# Altium schematic sheet Microcontroller.SchDoc: STM32F407 Main µController
size A4; Organization: Use Organization_Name in ProjParam; Address1: EFI & DBR; Address2: STI-IMT-LSRO1; Address3: EPFL; Address4: CH-1015 LAUSANNE; DocumentNumber: 11; Revision: A; SheetNumber: 12; SheetTotal: 2; ApprovedBy: Init ApprovedBy in DocParam; CheckedBy: Init CheckedBy in DocParam; Author: Init Author in DocParam; CompanyName: Init CompanyName in DocParam; DrawnBy: Init DrawBy in DocParam; Engineer: Init Engineer in DocParam; DocumentName: Init DocumentName in DocParam; ProjectName: Init ProjectName in DocParam
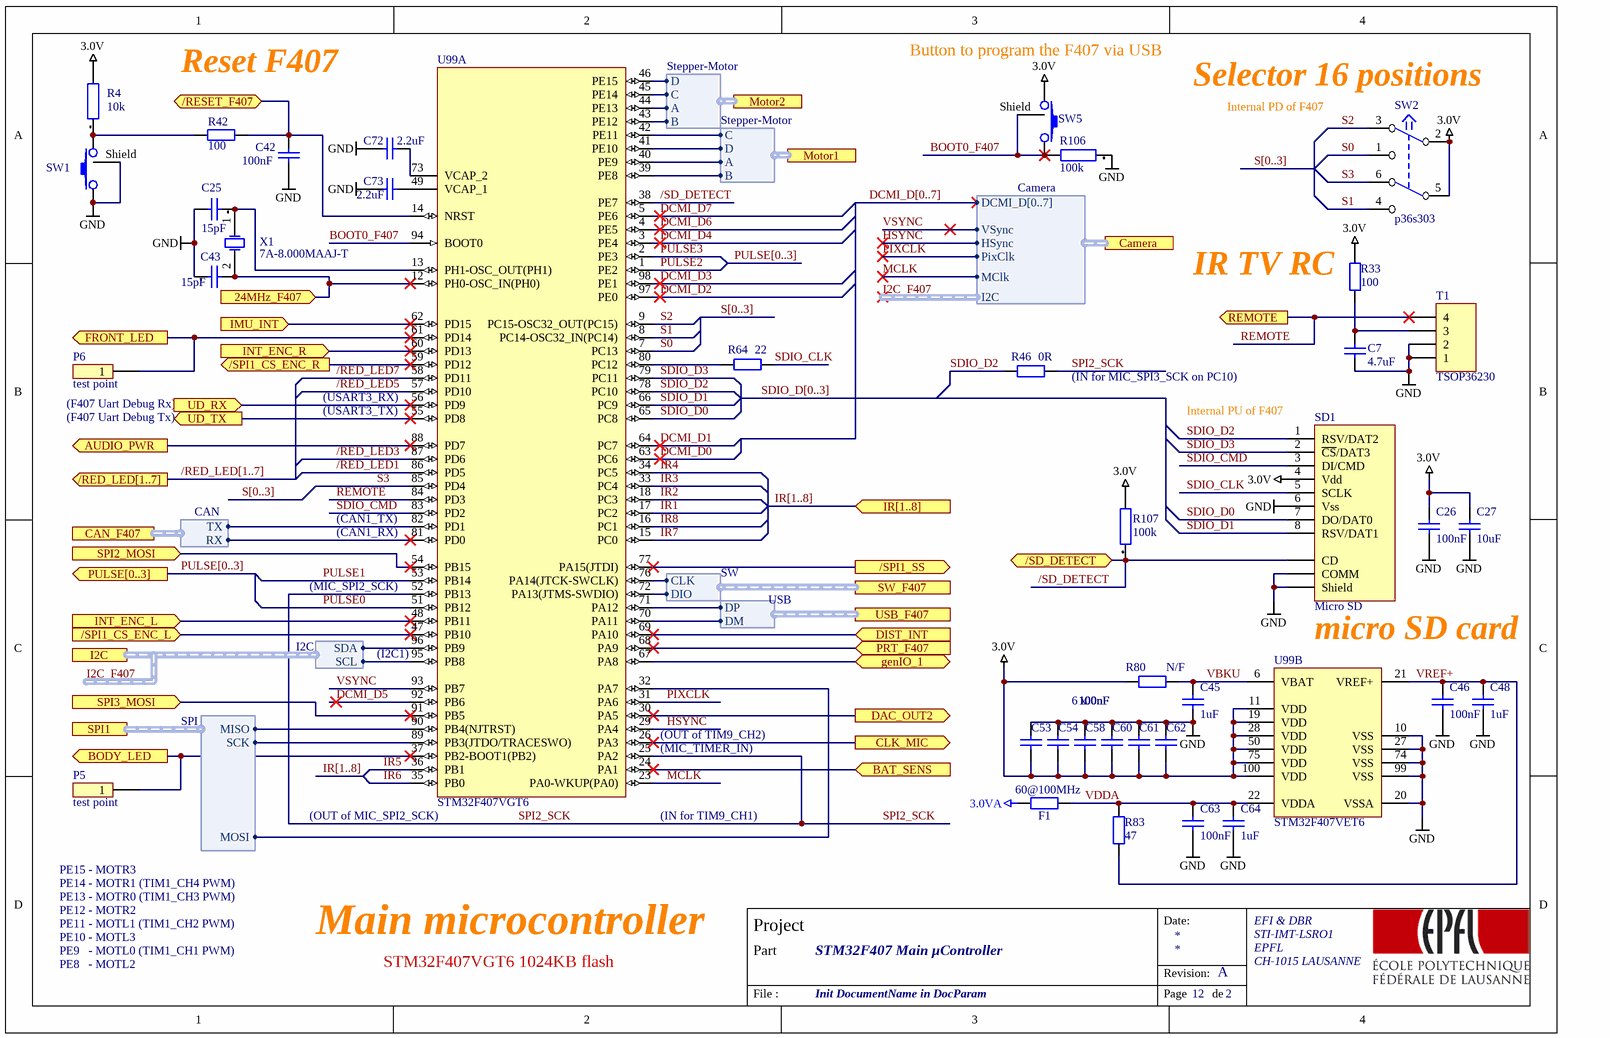
[diagram p0: Microcontroller.SchDoc]

## Parts
C7  4.7uF  [ROB_0603]
C25  15pF  [ROB_0603]
C26  100nF  [ROB_0603]
C27  10uF  [ROB_0603]
C42  100nF  [ROB_0603]
C43  15pF  [ROB_0603]
C45  1uF  [ROB_0603]
C46  100nF  [ROB_0603]
C48  1uF  [ROB_0603]
C53  100nF  [ROB_0603]
C54  100nF  [ROB_0603]
C58  100nF  [ROB_0603]
C60  100nF  [ROB_0603]
C61  100nF  [ROB_0603]
C62  100nF  [ROB_0603]
C63  100nF  [ROB_0603]
C64  1uF  [ROB_0603]
C72  2.2uF  [ROB_0603]
C73  2.2uF  [ROB_0603]
F1  60@100MHz  [rob_0603]
P5  test point  [testpoint]
P6  test point  [testpoint]
R4  10k  [ROB_0603]
R33  100  [ROB_0603]
R42  100  [ROB_0603]
R46  0R  [ROB_0603]
R64  22  [ROB_0603]
R80  N/F  [ROB_0603]
R83  47  [ROB_0603]
R106  100k  [ROB_0603]
R107  100k  [ROB_0603]
SD1  Micro SD  [MicroSD_DM3AT-SF-PEJM5]
SW1  button  [C&K_KMR2]  (value not drawn)
SW2  p36s303  [p36s]
SW5  button  [C&K_KMR2]  (value not drawn)
T1  TSOP36230  [TSOP36230]
U99  STM32F407VGT6  [STM-LQFP100_N]  (parts A,B of 2)
X1  7A-8.000MAAJ-T  [Crystal 8MHz 3.2x5mm-7A-8.000MAAJ-T]

## Ports
24MHz_F407 (in), /RED_LED[1..7] (out), /RESET_F407 (bidir), /SD_DETECT (bidir), /SPI1_CS_ENC_L (in), /SPI1_CS_ENC_R (out), /SPI1_SS (out), AUDIO_PWR (out), BAT_SENS (in), BODY_LED (out), Camera (harness Camera), CAN_F407 (harness CAN), CLK_MIC (out), DAC_OUT2 (out), DIST_INT (in), FRONT_LED (out), genIO_1 (bidir), I2C (harness I2C), IMU_INT (in), INT_ENC_L (in), INT_ENC_R (in), IR[1..8] (in), Motor1 (harness Stepper-Motor), Motor2 (harness Stepper-Motor), PRT_F407 (in), PULSE[0..3] (out), REMOTE (out), SPI1 (harness SPI), SPI2_MOSI (in), SPI3_MOSI (in), SW_F407 (harness SW), UD_RX (in), UD_TX (out), USB_F407 (harness USB)

## Harnesses
Camera: DCMI_D[0..7], HSync, VSync, MClk, PixClk, I2C
Stepper-Motor: A, B, C, D
CAN: TX, RX
SW: DIO, CLK
USB: DP, DM
I2C: SDA, SCL
SPI: SCK, MOSI, MISO

## Nets
3.0V: C26.2 C27.2 C53.1 C54.1 C58.1 C60.1 C61.1 C62.1 R4.2 R33.2 R80.2 R107.2 SD1.4(Vdd) SW2.2(COM1) SW2.5(COM2) SW5.2 U99.11(VDD) U99.19(VDD) U99.28(VDD) U99.50(VDD) U99.75(VDD) U99.100(VDD)
3.0VA: F1.1
GND: C7.1 C25.2 C26.1 C27.1 C42.2 C43.1 C45.1 C46.1 C48.1 C53.2 C54.2 C58.2 C60.2 C61.2 C62.2 C63.1 C64.1 C72.2 C73.1 R106.1 SD1.6(Vss) SD1.COMM SD1.S(Shield) SW1.1 SW1.Shield T1.1 T1.2 U99.10(VSS) U99.20(VSSA) U99.27(VSS) U99.74(VSS) U99.99(VSS)
24MHz_F407: C43.2 U99.12(PH0-OSC_IN(PH0)) X1.2(OSC2) ; port 24MHz_F407
/RED_LED1: U99.86(PD5)
/RED_LED3: U99.87(PD6)
/RED_LED5: U99.57(PD10)
/RED_LED7: U99.58(PD11)
/RESET_F407: C42.1 R42.2 U99.14(NRST) ; port /RESET_F407
/SD_DETECT: R107.1 SD1.CD U99.38(PE7) ; port /SD_DETECT
/SPI1_CS_ENC_L: U99.47(PB10) ; port /SPI1_CS_ENC_L
/SPI1_CS_ENC_R: U99.59(PD12) ; port /SPI1_CS_ENC_R
/SPI1_SS: U99.77(PA15(JTDI)) ; port /SPI1_SS
AUDIO_PWR: U99.88(PD7) ; port AUDIO_PWR
BAT_SENS: U99.24(PA1) ; port BAT_SENS
BODY_LED: P5.1 U99.37(PB2-BOOT1(PB2)) ; port BODY_LED
BOOT0_F407: R106.2 SW5.1 SW5.Shield U99.94(BOOT0)
CLK_MIC: U99.26(PA3) ; port CLK_MIC
DAC_OUT2: U99.30(PA5) ; port DAC_OUT2
DCMI_D0: U99.63(PC6)
DCMI_D1: U99.64(PC7)
DCMI_D2: U99.97(PE0)
DCMI_D3: U99.98(PE1)
DCMI_D4: U99.3(PE4)
DCMI_D5: U99.92(PB6)
DCMI_D6: U99.4(PE5)
DCMI_D7: U99.5(PE6)
DIST_INT: U99.69(PA10) ; port DIST_INT
FRONT_LED: P6.1 U99.61(PD14) ; port FRONT_LED
genIO_1: U99.67(PA8) ; port genIO_1
HSYNC: U99.29(PA4) ; port Camera.HSync
I2C_F407.SCL: U99.95(PB8) ; port I2C.SCL
I2C_F407.SDA: U99.96(PB9) ; port I2C.SDA
IMU_INT: U99.62(PD15) ; port IMU_INT
INT_ENC_L: U99.48(PB11) ; port INT_ENC_L
INT_ENC_R: U99.60(PD13) ; port INT_ENC_R
IR1: U99.17(PC2)
IR2: U99.18(PC3)
IR3: U99.33(PC4)
IR4: U99.34(PC5)
IR5: U99.36(PB1)
IR6: U99.35(PB0)
IR7: U99.15(PC0)
IR8: U99.16(PC1)
MCLK: U99.23(PA0-WKUP(PA0)) ; port Camera.MClk
PIXCLK: U99.31(PA6) ; port Camera.PixClk
PRT_F407: U99.68(PA9) ; port PRT_F407
PULSE0: U99.51(PB12)
PULSE1: U99.53(PB14)
PULSE2: U99.1(PE2)
PULSE3: U99.2(PE3)
REMOTE: T1.4 U99.84(PD3) ; port REMOTE
S0: SW2.1(NO1) U99.7(PC13)
S1: SW2.4(NO2) U99.8(PC14-OSC32_IN(PC14))
S2: SW2.3(NC1) U99.9(PC15-OSC32_OUT(PC15))
S3: SW2.6(NC2) U99.85(PD4)
SDIO_CLK: R64.1 SD1.5(SCLK)
SDIO_CMD: SD1.3(DI/CMD) U99.83(PD2)
SDIO_D0: SD1.7(DO/DAT0) U99.65(PC8)
SDIO_D1: SD1.8(RSV/DAT1) U99.66(PC9)
SDIO_D2: R46.2 SD1.1(RSV/DAT2) U99.78(PC10)
SDIO_D3: SD1.2(~{CS}/DAT3) U99.79(PC11)
SPI2_MOSI: U99.54(PB15) ; port SPI2_MOSI
SPI2_SCK: R46.1 U99.25(PA2) U99.52(PB13)
SPI3_MOSI: U99.91(PB5) ; port SPI3_MOSI
UD_RX: U99.56(PD9) ; port UD_RX
UD_TX: U99.55(PD8) ; port UD_TX
VBKU: C45.2 R80.1 U99.6(VBAT)
VDDA: C63.2 C64.2 F1.2 R83.1 U99.22(VDDA)
VREF+: C46.2 C48.2 R83.2 U99.21(VREF+)
VSYNC: U99.93(PB7) ; port Camera.VSync
NetC7_2: C7.2 R33.1 T1.3
NetC25_1: C25.1 U99.13(PH1-OSC_OUT(PH1)) X1.1(OSC1)
NetC72_1: C72.1 U99.73(VCAP_2)
NetC73_2: C73.2 U99.49(VCAP_1)
NetR4_1: R4.1 R42.1 SW1.2
NetR64_2: R64.2 U99.80(PC12)
NetU99_32: U99.32(PA7) ; port SPI1.MOSI
NetU99_39: U99.39(PE8) ; port Motor1.B
NetU99_40: U99.40(PE9) ; port Motor1.A
NetU99_41: U99.41(PE10) ; port Motor1.D
NetU99_42: U99.42(PE11) ; port Motor1.C
NetU99_43: U99.43(PE12) ; port Motor2.B
NetU99_44: U99.44(PE13) ; port Motor2.A
NetU99_45: U99.45(PE14) ; port Motor2.C
NetU99_46: U99.46(PE15) ; port Motor2.D
NetU99_70: U99.70(PA11) ; port USB_F407.DM
NetU99_71: U99.71(PA12) ; port USB_F407.DP
NetU99_72: U99.72(PA13(JTMS-SWDIO)) ; port SW_F407.DIO
NetU99_76: U99.76(PA14(JTCK-SWCLK)) ; port SW_F407.CLK
NetU99_81: U99.81(PD0) ; port CAN_F407.RX
NetU99_82: U99.82(PD1) ; port CAN_F407.TX
NetU99_89: U99.89(PB3(JTDO/TRACESWO)) ; port SPI1.SCK
NetU99_90: U99.90(PB4(NJTRST)) ; port SPI1.MISO

## Buses and harness runs
bus /RED_LED[1..7] = port /RED_LED[1..7]
bus DCMI_D[0..7]
bus IR[1..8]
bus IR[1..8] = port IR[1..8]
bus PULSE[0..3]
bus PULSE[0..3] = port PULSE[0..3]
bus S[0..3]
bus SDIO_D[0..3]
harness I2C_F407 = port I2C

## Notes on the sheet
- Reset F407
- (near SW5) Button to program the F407 via USB
- (near SW2) Selector 16 positions
- Internal PD of F407
- (near R33) IR TV RC
- (near R46) (IN for MIC_SPI3_SCK on PC10)
- (near P6) (F407 Uart Debug Tx)
- (near P6) (F407 Uart Debug Rx)
- (near U99) (USART3_TX)
- (near U99) (USART3_RX)
- (near SD1) Internal PU of F407
- (near U99) (CAN1_TX)
- (near U99) (CAN1_RX)
- (near U99) (MIC_SPI2_SCK)
- (near U99) (I2C1)
- micro SD card
- 6 x
- (near U99) (MIC_TIMER_IN)
- (near U99) (OUT of TIM9_CH2)
- (near U99) (OUT of MIC_SPI2_SCK)
- (near U99) (IN for TIM9_CH1)
- PE11 - MOTL1 (TIM1_CH2 PWM)
- PE13 - MOTR0 (TIM1_CH3 PWM)
- PE14 - MOTR1 (TIM1_CH4 PWM)
- PE12 - MOTR2
- PE15 - MOTR3
- PE9   - MOTL0 (TIM1_CH1 PWM)
- PE8   - MOTL2
- PE10 - MOTL3
- Main microcontroller
- STM32F407VGT6 1024KB flash
- Date:
- Project
- Part
- Revision:
- File :
- Page
- de

## Library data of the parts
C7 C26 C27 C42 C45 C46 C48 C53 C54 C58 C60-C64 C72 C73 = Cap: Capacitor; Published: 8-Jun-2000; LatestRevisionDate: 17-Jul-2002; LatestRevisionNote: Re-released for DXP Platform.; PackageReference: RAD-0.3; Publisher: Altium Limited
  C7: Value: 4.7uF
  C26 C42 C46 C53 C54 C58 C60-C63: Value: 100nF
  C27: Value: 10uF
  C45 C48 C64: Value: 1uF
  C72 C73: Value: 2.2uF
C25 C43 = 27pF[[/\]]0603[[/\]]1: Capacitor; Manufacturer: Phycomp; Manufacturer Nr: 2238 867 15279; Preference: 1; Tolerance +: +5; Tolerance -: -5; Dielectric: NPO; Voltage: 50; MaxTemperature: +125; MinTemperature: -55; Quant_1: 10; Quant_2: 100; Quant_3: 1000; Quant_4: 10000; Currentie: CHF; Size: 0603; Footprint Acort: 0603_G; Supplier: Farnell; Supplier Nr: 722017; ComponentLink2Description: Farnell link; ComponentLink2URL: http://ch.farnell.com/jsp/displayProduct.jsp?sku=722017; Price_1: 0,115; Price_2: 0,105; Price_3: 0,095; Price_4: 0,073; ROHS: True; DateLastUpdate: 2007-12-03 / 14:22:55; Value: 15pF
F1 = RES_0603: Bead Ferrite; Value: ex farnell 1669742
P5 P6 = Header 1: Header, 1-Pin,  bottom; Manufacturer: Generic Components; Class I: Connector; Revision: July-2002: Re-released for DXP Platform.; Publisher: Altium Limited; value: keystone 4952
R4 R106 R107 = 100K[[/\]]0603[[/\]]2: Resistor; Manufacturer: Multicomp; Manufacturer Nr: MC 0.063W 0603 1% 100K; Tolerance: +/-1; Preference: 2; Power: 0.063; Voltage: 50; Current: 1; ppm/K: +/-100; Quant_2: 250; Quant_3: 1000; Quant_4: 5000; Quant_5: 15000; Currentie: CHF; Size: 0603; Footprint Acort: 0603; ComponentLink1Description: OnLine datasheet; Supplier: Farnell; Supplier Nr: 9330402; ComponentLink2Description: Farnell link; ComponentLink2URL: http://ch.farnell.com/jsp/displayProduct.jsp?sku=9330402; ROHS: True; Quant_1: 50; Price_1: 0,062; Price_2: 0,049; Price_3: 0,038; Price_4: 0,027; Price_5: 0,021; DateLastUpdate: 2007-11-29 / 09:15:00
  R4: Value: 10k
  R106 R107: Value: 100k
R33 R42 R46 R64 R80 R83 = Res2: Resistor; Published: 8-Jun-2000; LatestRevisionDate: 17-Jul-2002; LatestRevisionNote: Re-released for DXP Platform.; PackageReference: AXIAL-0.4; Publisher: Altium Limited
  R33 R42: Value: 100
  R46: Value: 0R
  R64: Value: 22
  R80: Value: N/F
  R83: Value: 47
SD1 = CON Micro SD DM3AT-SF-PEJM5: uSD Connector HRS DM3AT-SF-PEJM5; Manufacturer: Generic Components; value: mouser DM3AT-SF-PEJM5; Revision: July-2002: Re-released for DXP Platform.; Publisher: Altium Limited; Class I: Connector
SW1 SW5 = MM6FVS[[/\]]1: KMR221GLFS; Manufacturer: Tyco; Manufacturer Nr: 7-188275-6; Preference: 1; Currentie: CHF; Quant_1: 10; Quant_2: 900; Circuit: SPST-NO; Switch Function: Off-Mom; Contact Rating @ Voltage: 0.05A @ 32VDC; Actuator Type: Standard; Actuator Height off PCB, from Pins: 1.90mm; Actuator Orientation: Top Actuated; Outline: 4.60mm x 2.80mm; Illumination: Non-Illuminated; Operating Force: 200gf; Switch Travel: 0.25mm; Mechanical Life: 200,000 Cycles; Footprint Acort: ToDefine; ComponentLink1Description: Datasheet; ComponentLink1URL: http://ecommas.tycoelectronics.com/commerce/DocumentDelivery/DDEController?Action=showdoc&DocId=Customer+Drawing%7F188275%7FR%7Fpdf%7FEnglish%7FC_188275_R.pdf; Supplier: Farnell; Supplier Nr: 1056234; ComponentLink2Description: Farnell link; ComponentLink2URL: http://fr.farnell.com/jsp/displayProduct.jsp?sku=1056234; ROHS: True; Type: SMD; Orientation: Vertical; DateLastUpdate: 2007-12-04 / 09:15:57; Price_1: 1,1; Price_2: 0,924; Supplier 1: Digi-Key; Manufacturer Part Number: KMR221GLFS; Category: Switches; Stock 1: 20549; Pricing 1: 1=0.51, 10=0.493, 25=0.484, 50=0.4656, 100=0.4017, 250=0.3652, 500=0.34694, 1000=0.2739 (USD); Packaging: Cut Tape (CT); Mounting Type: Surface Mount; Termination Style: Gull Wing; Illumination Voltage (Nominal): -; Illumination Type, Color: -; Ingress Protection: -; Features: Grounding Pin; Actuator Material: -; Operating Temperature: -40°C ~ 85°C; ComponentLink3URL: http://www.ck-components.com/index.php?module=media&action=Display&cmpref=14414&lang=en&width=&height=&format=&alt=; ComponentLink3Description: http://www.ck-components.com/index.php?module=media&action=Display&cmpref=14414&lang=en&width=&height=&format=&alt=; Supplier Part Number 1: 401-1427-1-ND
SW2 = MB2061: hex selector; value: p36s303 or 220AMC16R
T1 = Header 4: IT TV receiver; LatestRevisionDate: 17-Jul-2002; LatestRevisionNote: Re-released for DXP Platform.; Publisher: Altium Limited
U99 = STM32F407VET6: ARM Cortex-M4 32-bit MCU+FPU, 210 DMIPS, 512 kB Flash, 192 kB Internal RAM, 82 I/Os, 100-pin LQFP, -40 to 85 degC, Tray; Manufacturer: STMicroelectronics; D/A Converter: 2x12-bit; FLASH Size (Prog) (kB): 512; I/Os (High Current): 82; Internal RAM Size (kB): 192; Operating Frequency(F) (Processor speed) (MHz): 168; Supply Voltage(Vcc) max (V): 3.6; Supply Voltage(Vcc) min (V): 1.8; DatasheetVersion: Rev. 4; PackageVersion: Rev. 1, 06/2013; PackageReference: LQFP100; PackageDescription: 100-Pin Low Profile Quad Flat Package, 14 x 14 mm Body, 0.5 mm Pitch; Supplier 1: Digi-Key; Supplier Part Number 1: 497-12075-ND; Supplier 2: Farnell; Supplier Part Number 2: 2064367; Supplier 3: Newark; Supplier Part Number 3: 73T2332; Supplier 4: Mouser; Supplier Part Number 4: 511-STM32F407VET6; Core: ARM Cortex-M4; Packing: Tray; Mounting Technology: Surface Mount; PartNumber: STM32F407VET6; ComponentLink1Description: Manufacturer URL; ComponentLink1URL: http://www.st.com/web/en/home.html; ComponentLink2Description: Datasheet; ComponentLink2URL: http://www.st.com/st-web-ui/static/active/en/resource/technical/document/datasheet/DM00037051.pdf; ComponentLink3Description: Package Specification; ComponentLink3URL: http://www.st.com/st-web-ui/static/active/en/resource/technical/document/data_brief/DM00071938.pdf
X1 = 7A-8.000MAAJ-T: CRYSTAL 8.0000MHZ 18PF SMD; Manufacturer: TXC CORPORATION; Manufacturer Part Number: 7A-8.000MAAJ-T*; Frequency: 8MHz; Frequency Stability: ±30ppm; ESR (Equivalent Series Resistance): 80 Ohm; Operating Mode: Fundamental; Supplier 1: Digi-Key; RoHS: RoHS Compliant; Category: Crystals, Oscillators, Resonators; Stock 1: 33903; Pricing 1: 1=0.72, 10=0.633, 50=0.5912, 100=0.5225, 500=0.495 (USD); Packaging: Cut Tape (CT); Part Status: Active; Type: MHz Crystal; Frequency Tolerance: ±30ppm; Load Capacitance: 18pF; Operating Temperature: -20°C ~ 70°C; Ratings: -; Mounting Type: Surface Mount; Package / Case: 2-SMD, No Lead; Size / Dimension: 0.197" L x 0.126" W (5.00mm x 3.20mm); Height - Seated (Max): 0.053" (1.35mm); ComponentLink1URL: http://www.txccorp.com/download/products/quartz_crystals/2015TXC_7A_28.pdf; ComponentLink1Description: http://www.txccorp.com/download/products/quartz_crystals/2015TXC_7A_28.pdf; Supplier Part Number 1: 887-1448-1-ND